# EAGLE schematic untitled (EAGLE 8.7.0)
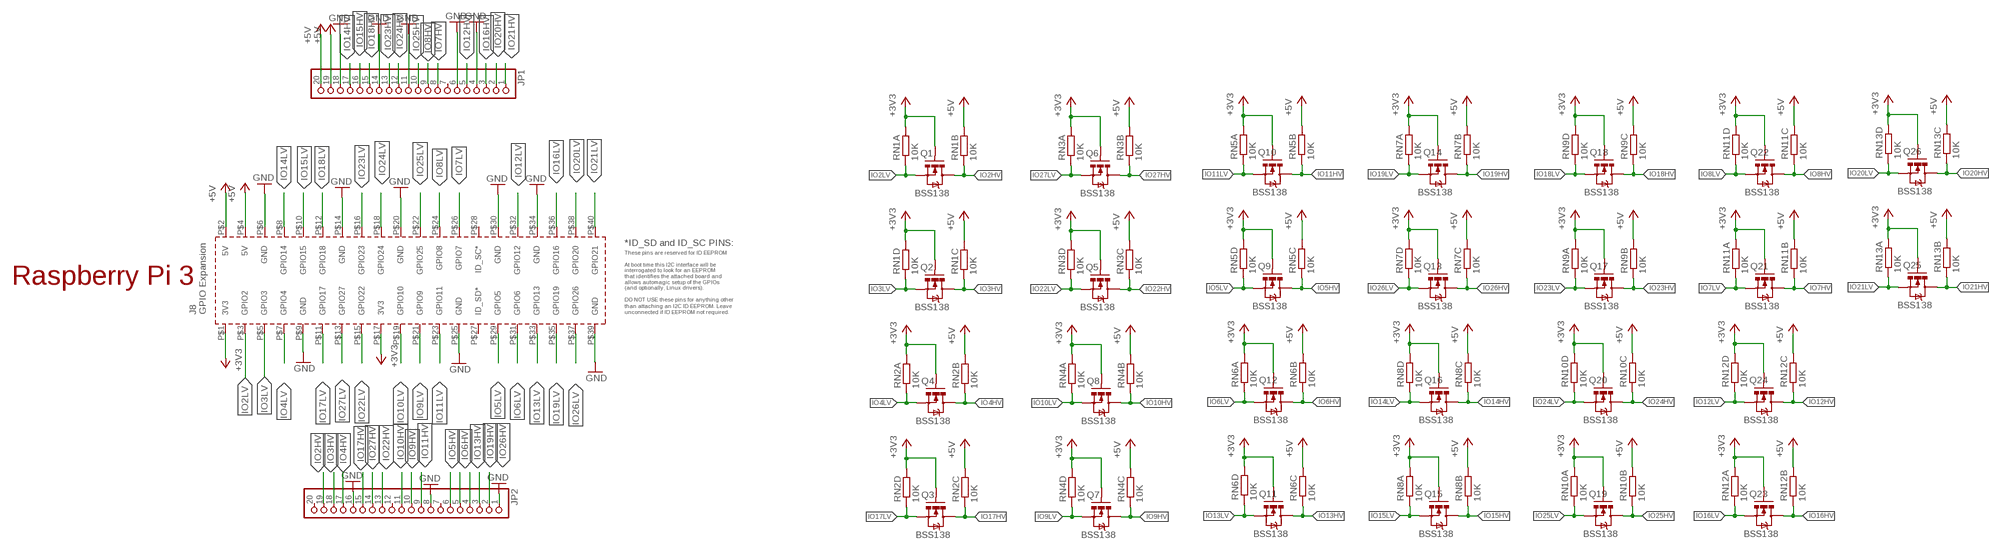
[diagram p0: schematic, sheet 1]

## Parts
JP1  PINHD-1X20-BIG  [1X20-BIG]
JP2  PINHD-1X20-BIG  [1X20-BIG]
Q1  BSS138  MOSFET-NCHANNELSMD  [SOT23-3]
Q2  BSS138  MOSFET-NCHANNELSMD  [SOT23-3]
Q3  BSS138  MOSFET-NCHANNELSMD  [SOT23-3]
Q4  BSS138  MOSFET-NCHANNELSMD  [SOT23-3]
Q5  BSS138  MOSFET-NCHANNELSMD  [SOT23-3]
Q6  BSS138  MOSFET-NCHANNELSMD  [SOT23-3]
Q7  BSS138  MOSFET-NCHANNELSMD  [SOT23-3]
Q8  BSS138  MOSFET-NCHANNELSMD  [SOT23-3]
Q9  BSS138  MOSFET-NCHANNELSMD  [SOT23-3]
Q10  BSS138  MOSFET-NCHANNELSMD  [SOT23-3]
Q11  BSS138  MOSFET-NCHANNELSMD  [SOT23-3]
Q12  BSS138  MOSFET-NCHANNELSMD  [SOT23-3]
Q13  BSS138  MOSFET-NCHANNELSMD  [SOT23-3]
Q14  BSS138  MOSFET-NCHANNELSMD  [SOT23-3]
Q15  BSS138  MOSFET-NCHANNELSMD  [SOT23-3]
Q16  BSS138  MOSFET-NCHANNELSMD  [SOT23-3]
Q17  BSS138  MOSFET-NCHANNELSMD  [SOT23-3]
Q18  BSS138  MOSFET-NCHANNELSMD  [SOT23-3]
Q19  BSS138  MOSFET-NCHANNELSMD  [SOT23-3]
Q20  BSS138  MOSFET-NCHANNELSMD  [SOT23-3]
Q21  BSS138  MOSFET-NCHANNELSMD  [SOT23-3]
Q22  BSS138  MOSFET-NCHANNELSMD  [SOT23-3]
Q23  BSS138  MOSFET-NCHANNELSMD  [SOT23-3]
Q24  BSS138  MOSFET-NCHANNELSMD  [SOT23-3]
Q25  BSS138  MOSFET-NCHANNELSMD  [SOT23-3]
Q26  BSS138  MOSFET-NCHANNELSMD  [SOT23-3]
RN1  10K  RESISTOR_ARRAY_4  [RN8P-4R-CRA06S]
RN2  10K  RESISTOR_ARRAY_4  [RN8P-4R-CRA06S]
RN3  10K  RESISTOR_ARRAY_4  [RN8P-4R-CRA06S]
RN4  10K  RESISTOR_ARRAY_4  [RN8P-4R-CRA06S]
RN5  10K  RESISTOR_ARRAY_4  [RN8P-4R-CRA06S]
RN6  10K  RESISTOR_ARRAY_4  [RN8P-4R-CRA06S]
RN7  10K  RESISTOR_ARRAY_4  [RN8P-4R-CRA06S]
RN8  10K  RESISTOR_ARRAY_4  [RN8P-4R-CRA06S]
RN9  10K  RESISTOR_ARRAY_4  [RN8P-4R-CRA06S]
RN10  10K  RESISTOR_ARRAY_4  [RN8P-4R-CRA06S]
RN11  10K  RESISTOR_ARRAY_4  [RN8P-4R-CRA06S]
RN12  10K  RESISTOR_ARRAY_4  [RN8P-4R-CRA06S]
RN13  10K  RESISTOR_ARRAY_4  [RN8P-4R-CRA06S]
U$2  RPI3HEADERS  [RPI3HEADERS]

## Nets
+3V3: Q1.1(G) Q2.1(G) Q3.1(G) Q4.1(G) Q5.1(G) Q6.1(G) Q7.1(G) Q8.1(G) Q9.1(G) Q10.1(G) Q11.1(G) Q12.1(G) Q13.1(G) Q14.1(G) Q15.1(G) Q16.1(G) Q17.1(G) Q18.1(G) Q19.1(G) Q20.1(G) Q21.1(G) Q22.1(G) Q23.1(G) Q24.1(G) Q25.1(G) Q26.1(G) RN1.5 RN1.8 RN2.5 RN2.8 RN3.5 RN3.8 RN4.5 RN4.8 RN5.5 RN5.8 RN6.5 RN6.8 RN7.5 RN7.8 RN8.5 RN8.8 RN9.5 RN9.8 RN10.5 RN10.8 RN11.5 RN11.8 RN12.5 RN12.8 RN13.5 RN13.8 U$2.P$1(3V3) U$2.P$17(3V3)
+5V: JP1.19 JP1.20 RN1.6 RN1.7 RN2.6 RN2.7 RN3.6 RN3.7 RN4.6 RN4.7 RN5.6 RN5.7 RN6.6 RN6.7 RN7.6 RN7.7 RN8.6 RN8.7 RN9.6 RN9.7 RN10.6 RN10.7 RN11.6 RN11.7 RN12.6 RN12.7 RN13.6 RN13.7 U$2.P$2(5V) U$2.P$4(5V)
GND: JP1.4 JP1.6 JP1.11 JP1.14 JP1.18 JP2.1 JP2.8 JP2.16 U$2.P$6(GND) U$2.P$9(GND) U$2.P$14(GND) U$2.P$20(GND) U$2.P$25(GND) U$2.P$30(GND) U$2.P$34(GND) U$2.P$39(GND)
IO2HV: JP2.19 Q1.3(D) RN1.2
IO2LV: Q1.2(S) RN1.1 U$2.P$3(GPIO2)
IO3HV: JP2.18 Q2.3(D) RN1.3
IO3LV: Q2.2(S) RN1.4 U$2.P$5(GPIO3)
IO4HV: JP2.17 Q4.3(D) RN2.2
IO4LV: Q4.2(S) RN2.1 U$2.P$7(GPIO4)
IO5HV: JP2.6 Q9.3(D) RN5.3
IO5LV: Q9.2(S) RN5.4 U$2.P$29(GPIO5)
IO6HV: JP2.5 Q12.3(D) RN6.2
IO6LV: Q12.2(S) RN6.1 U$2.P$31(GPIO6)
IO7HV: JP1.8 Q21.3(D) RN11.2
IO7LV: Q21.2(S) RN11.1 U$2.P$26(GPIO7)
IO8HV: JP1.9 Q22.3(D) RN11.3
IO8LV: Q22.2(S) RN11.4 U$2.P$24(GPIO8)
IO9HV: JP2.10 Q7.3(D) RN4.3
IO9LV: Q7.2(S) RN4.4 U$2.P$21(GPIO9)
IO10HV: JP2.11 Q8.3(D) RN4.2
IO10LV: Q8.2(S) RN4.1 U$2.P$19(GPIO10)
IO11HV: JP2.9 Q10.3(D) RN5.2
IO11LV: Q10.2(S) RN5.1 U$2.P$23(GPIO11)
IO12HV: JP1.5 Q24.3(D) RN12.3
IO12LV: Q24.2(S) RN12.4 U$2.P$32(GPIO12)
IO13HV: JP2.4 Q11.3(D) RN6.3
IO13LV: Q11.2(S) RN6.4 U$2.P$33(GPIO13)
IO14HV: JP1.17 Q16.3(D) RN8.3
IO14LV: Q16.2(S) RN8.4 U$2.P$8(GPIO14)
IO15HV: JP1.16 Q15.3(D) RN8.2
IO15LV: Q15.2(S) RN8.1 U$2.P$10(GPIO15)
IO16HV: JP1.3 Q23.3(D) RN12.2
IO16LV: Q23.2(S) RN12.1 U$2.P$36(GPIO16)
IO17HV: JP2.15 Q3.3(D) RN2.3
IO17LV: Q3.2(S) RN2.4 U$2.P$11(GPIO17)
IO18HV: JP1.15 Q18.3(D) RN9.3
IO18LV: Q18.2(S) RN9.4 U$2.P$12(GPIO18)
IO19HV: JP2.3 Q14.3(D) RN7.2
IO19LV: Q14.2(S) RN7.1 U$2.P$35(GPIO19)
IO20HV: JP1.2 Q26.3(D) RN13.3
IO20LV: Q26.2(S) RN13.4 U$2.P$38(GPIO20)
IO21HV: JP1.1 Q25.3(D) RN13.2
IO21LV: Q25.2(S) RN13.1 U$2.P$40(GPIO21)
IO22HV: JP2.13 Q5.3(D) RN3.3
IO22LV: Q5.2(S) RN3.4 U$2.P$15(GPIO22)
IO23HV: JP1.13 Q17.3(D) RN9.2
IO23LV: Q17.2(S) RN9.1 U$2.P$16(GPIO23)
IO24HV: JP1.12 Q20.3(D) RN10.3
IO24LV: Q20.2(S) RN10.4 U$2.P$18(GPIO24)
IO25HV: JP1.10 Q19.3(D) RN10.2
IO25LV: Q19.2(S) RN10.1 U$2.P$22(GPIO25)
IO26HV: JP2.2 Q13.3(D) RN7.3
IO26LV: Q13.2(S) RN7.4 U$2.P$37(GPIO26)
IO27HV: JP2.14 Q6.3(D) RN3.2
IO27LV: Q6.2(S) RN3.1 U$2.P$13(GPIO27)
Unconnected: JP1.7 JP2.7 JP2.12 JP2.20 U$2.P$27(ID_SD*) U$2.P$28(ID_SC*)

## Library data of the parts
JP1 JP2 = adafruit:PINHD-1X20: PIN HEADER
Q1-Q26 = SparkFun:MOSFET-NCHANNEL
RN1-RN13 = dp_devices:RESISTOR_ARRAY_4: 4 Resistor Array 0603
U$2 = Rheyd:RPI3HEADERS